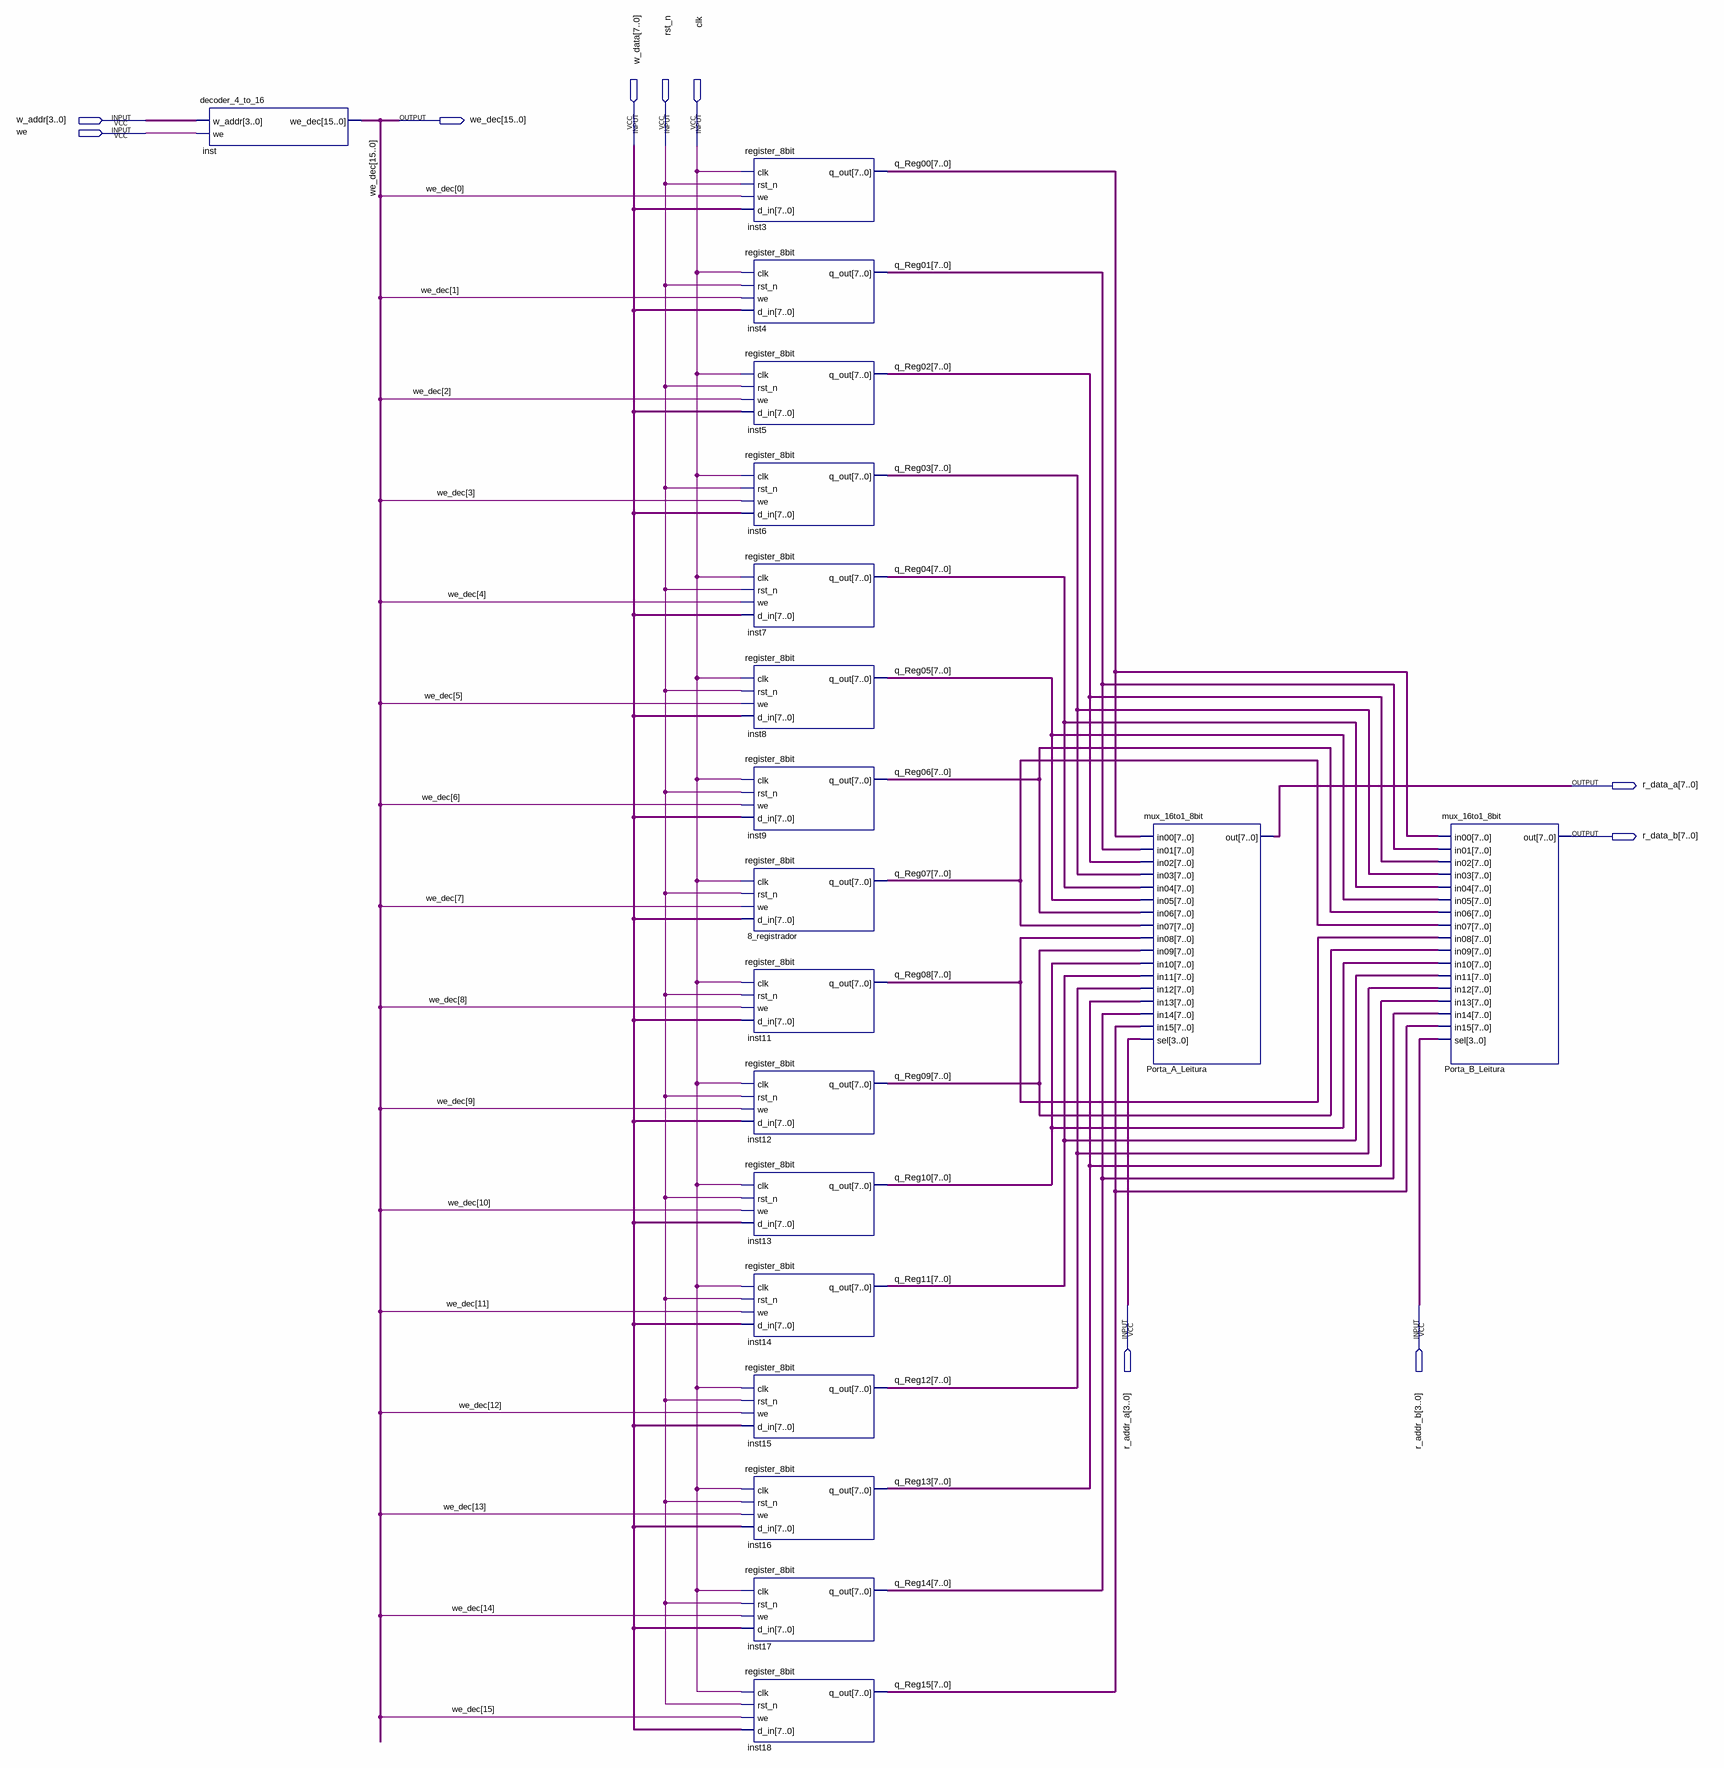
[diagram p0: schematic sheet]
// Quartus schematic banco_de_registadores_top.bdf as structural Verilog: 19 symbols, 10 pins
module banco_de_registadores_top (
  input  [3:0] w_addr,
  input  we,
  input  [7:0] w_data,
  input  rst_n,
  input  clk,
  input  [3:0] r_addr_a,
  input  [3:0] r_addr_b,
  output [15:0] we_dec,
  output [7:0] r_data_a,
  output [7:0] r_data_b
);

  wire [7:0] q_Reg00, q_Reg01, q_Reg02, q_Reg03, q_Reg04, q_Reg05, q_Reg06, q_Reg07, q_Reg08, q_Reg09,
       q_Reg10, q_Reg11, q_Reg12, q_Reg13, q_Reg14, q_Reg15;

  decoder_4_to_16 inst (.w_addr(w_addr), .we(we), .we_dec(we_dec));
  register_8bit inst3 (.clk(clk), .rst_n(rst_n), .we(we_dec[0]), .d_in(w_data), .q_out(q_Reg00));
  register_8bit inst4 (.clk(clk), .rst_n(rst_n), .we(we_dec[1]), .d_in(w_data), .q_out(q_Reg01));
  register_8bit inst5 (.clk(clk), .rst_n(rst_n), .we(we_dec[2]), .d_in(w_data), .q_out(q_Reg02));
  register_8bit inst6 (.clk(clk), .rst_n(rst_n), .we(we_dec[3]), .d_in(w_data), .q_out(q_Reg03));
  register_8bit inst7 (.clk(clk), .rst_n(rst_n), .we(we_dec[4]), .d_in(w_data), .q_out(q_Reg04));
  register_8bit inst8 (.clk(clk), .rst_n(rst_n), .we(we_dec[5]), .d_in(w_data), .q_out(q_Reg05));
  register_8bit inst9 (.clk(clk), .rst_n(rst_n), .we(we_dec[6]), .d_in(w_data), .q_out(q_Reg06));
  register_8bit u_8_registrador (.clk(clk), .rst_n(rst_n), .we(we_dec[7]), .d_in(w_data), .q_out(q_Reg07));
  register_8bit inst11 (.clk(clk), .rst_n(rst_n), .we(we_dec[8]), .d_in(w_data), .q_out(q_Reg08));
  register_8bit inst12 (.clk(clk), .rst_n(rst_n), .we(we_dec[9]), .d_in(w_data), .q_out(q_Reg09));
  register_8bit inst13 (.clk(clk), .rst_n(rst_n), .we(we_dec[10]), .d_in(w_data), .q_out(q_Reg10));
  register_8bit inst14 (.clk(clk), .rst_n(rst_n), .we(we_dec[11]), .d_in(w_data), .q_out(q_Reg11));
  register_8bit inst15 (.clk(clk), .rst_n(rst_n), .we(we_dec[12]), .d_in(w_data), .q_out(q_Reg12));
  register_8bit inst16 (.clk(clk), .rst_n(rst_n), .we(we_dec[13]), .d_in(w_data), .q_out(q_Reg13));
  register_8bit inst17 (.clk(clk), .rst_n(rst_n), .we(we_dec[14]), .d_in(w_data), .q_out(q_Reg14));
  register_8bit inst18 (.clk(clk), .rst_n(rst_n), .we(we_dec[15]), .d_in(w_data), .q_out(q_Reg15));
  mux_16to1_8bit Porta_A_Leitura (
    .in00(q_Reg00), .in01(q_Reg01), .in02(q_Reg02), .in03(q_Reg03), .in04(q_Reg04), .in05(q_Reg05),
    .in06(q_Reg06), .in07(q_Reg07), .in08(q_Reg08), .in09(q_Reg09), .in10(q_Reg10), .in11(q_Reg11),
    .in12(q_Reg12), .in13(q_Reg13), .in14(q_Reg14), .in15(q_Reg15), .sel(r_addr_a), .out(r_data_a));
  mux_16to1_8bit Porta_B_Leitura (
    .in00(q_Reg00), .in01(q_Reg01), .in02(q_Reg02), .in03(q_Reg03), .in04(q_Reg04), .in05(q_Reg05),
    .in06(q_Reg06), .in07(q_Reg07), .in08(q_Reg08), .in09(q_Reg09), .in10(q_Reg10), .in11(q_Reg11),
    .in12(q_Reg12), .in13(q_Reg13), .in14(q_Reg14), .in15(q_Reg15), .sel(r_addr_b), .out(r_data_b));
endmodule
